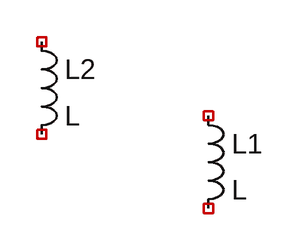
[diagram p0: schematic test.asc]
test.asc, the LTspice schematic file:
Version 4
SHEET 1 880 680
SYMBOL ind 160 112 R0
SYMATTR InstName L1
SYMBOL ind 16 48 R0
SYMATTR InstName L2

The netlist it stands for:
* test.asc
L1 NC_01 NC_02 L
L2 NC_03 NC_04 L
.backanno
.end